# Altium project MSE-IHM-N1.PrjPcb
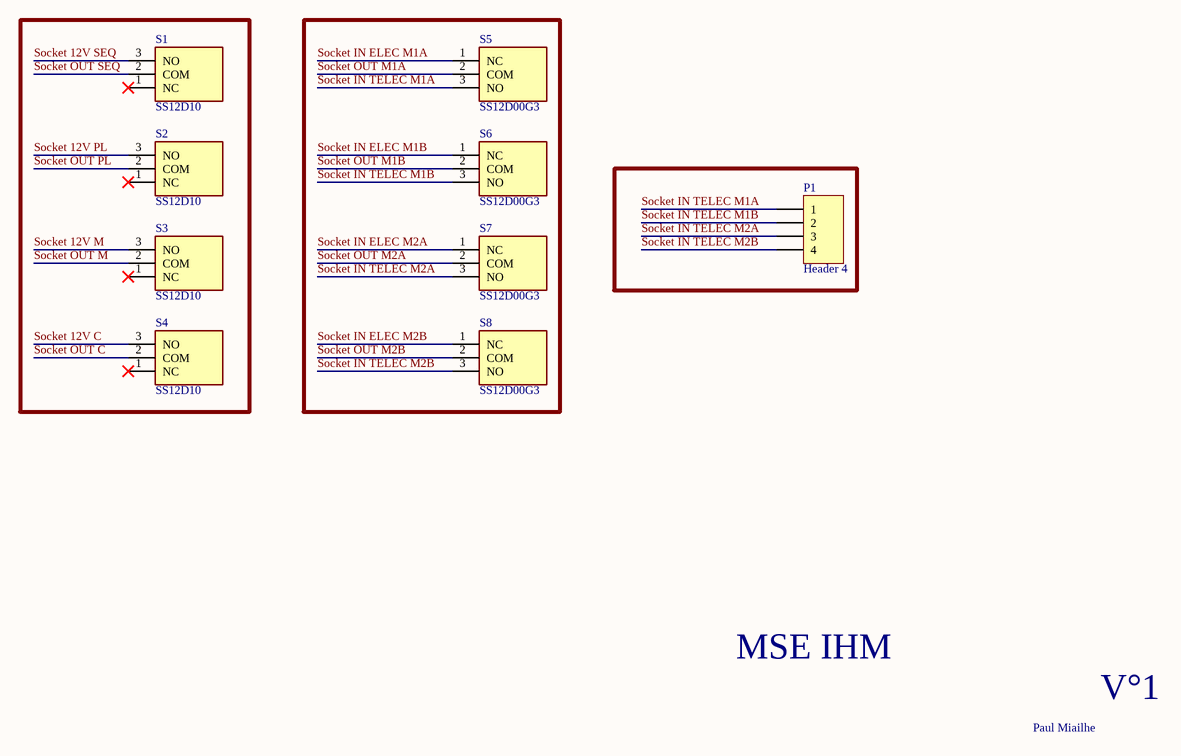
[diagram p0: MainSheet.SchDoc]
1 sheet, 9 parts. Net scope: global (net labels, ports and power ports of the same name join across sheets).
Board file: MSE-PCB-N2.PcbDoc

## Sheet MainSheet.SchDoc
size A4; SheetNumber: 1; SheetTotal: 1

### Parts
P1  Header 4  [HDR1X4]
S1  SS12D10  [SS12D10]
S2  SS12D10  [SS12D10]
S3  SS12D10  [SS12D10]
S4  SS12D10  [SS12D10]
S5  SS12D00G3  [SS12D00G3]
S6  SS12D00G3  [SS12D00G3]
S7  SS12D00G3  [SS12D00G3]
S8  SS12D00G3  [SS12D00G3]

### Nets
Socket 12V C: S4.3(NO)
Socket 12V M: S3.3(NO)
Socket 12V PL: S2.3(NO)
Socket 12V SEQ: S1.3(NO)
Socket IN ELEC M1A: S5.1(NC)
Socket IN ELEC M1B: S6.1(NC)
Socket IN ELEC M2A: S7.1(NC)
Socket IN ELEC M2B: S8.1(NC)
Socket IN TELEC M1A: P1.1 S5.3(NO)
Socket IN TELEC M1B: P1.2 S6.3(NO)
Socket IN TELEC M2A: P1.3 S7.3(NO)
Socket IN TELEC M2B: P1.4 S8.3(NO)
Socket OUT C: S4.2(COM)
Socket OUT M: S3.2(COM)
Socket OUT M1A: S5.2(COM)
Socket OUT M1B: S6.2(COM)
Socket OUT M2A: S7.2(COM)
Socket OUT M2B: S8.2(COM)
Socket OUT PL: S2.2(COM)
Socket OUT SEQ: S1.2(COM)

Not connected (* = marked no-connect by the designer): S1 1(NC)*; S2 1(NC)*; S3 1(NC)*; S4 1(NC)*

### Notes on the sheet
- MSE IHM
- V°1
- Paul Miailhe

### Library data of the parts
P1 = Header 4: Header, 4-Pin; LatestRevisionDate: 17-Jul-2002; LatestRevisionNote: Re-released for DXP Platform.; Publisher: Altium Limited
S1-S4 = SS12D10: Switch; Manufacturer_Name: DAIER; Datasheet Link: https://www.chinadaier.com/slide-switch-spdt/; Height: 9.91mm; Manufacturer_Part_Number: SS12D10
S5-S8 = SS12D00G3: Switch; Manufacturer_Name: Vimex; Datasheet Link: http://vimex.com/switches/techdocs/SS12D00-tech.pdf; Height: 7mm; Manufacturer_Part_Number: SS12D00G3